# Altium schematic sheet Capstone.SchDoc
size A
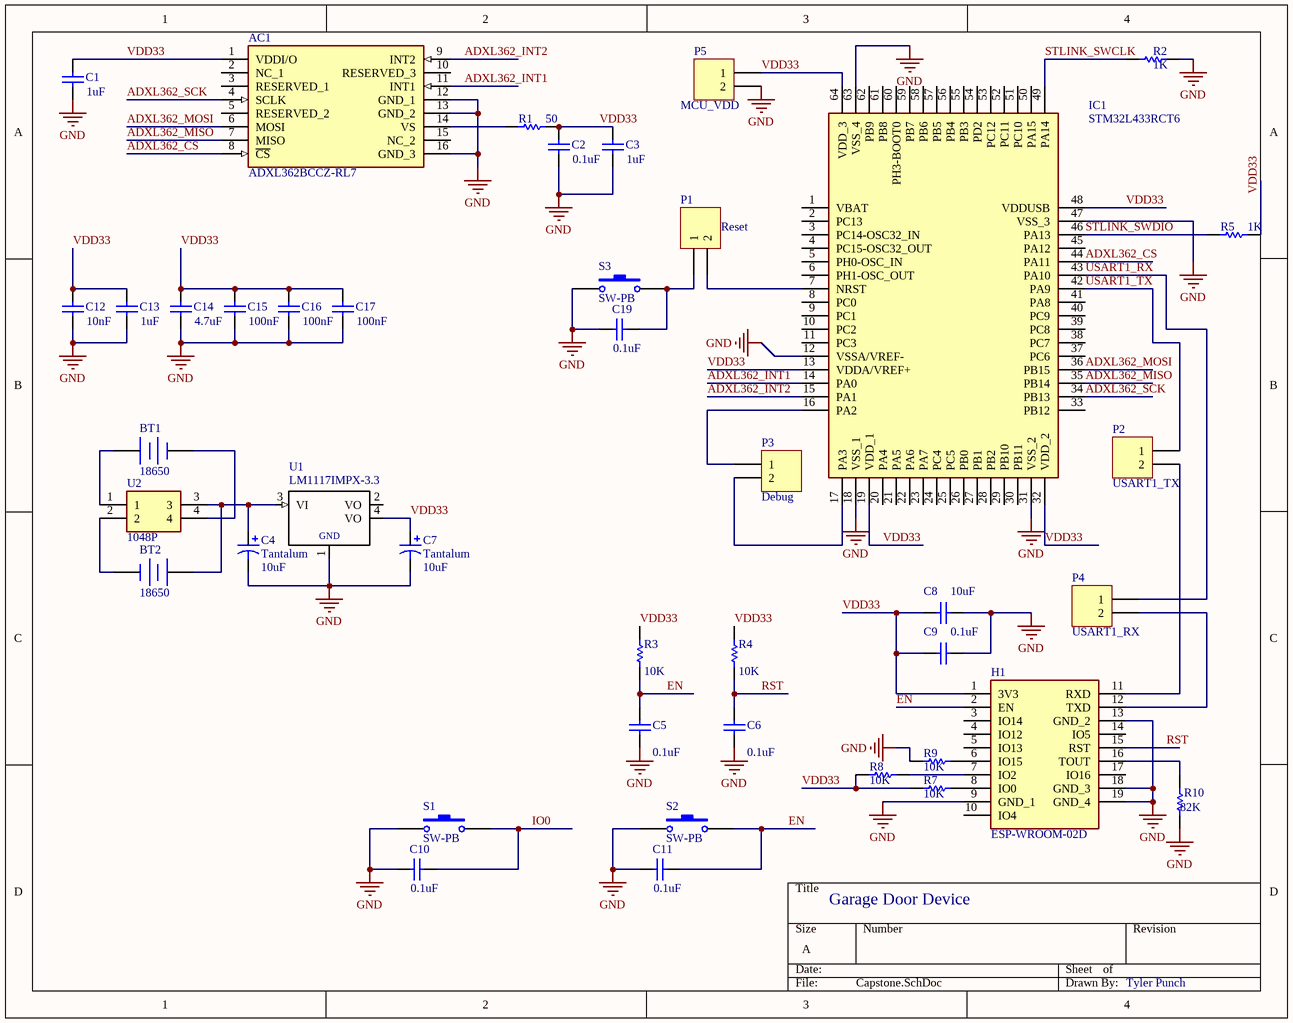
[diagram p0: Capstone.SchDoc]

## Parts
AC1  ADXL362BCCZ-RL7  [CC-16-4]
BT1  18650  [BAT-2]
BT2  18650  [BAT-2]
C1  value 1uF  [*CAPC2012X88N]  (hidden comment: Cap)
C2  value 0.1uF  [*CAPC2012X88N]  (hidden comment: Cap)
C3  value 1uF  [*CAPC2012X88N]  (hidden comment: Cap)
C4  Tantalum  value 10uF  [RB7.6-15]
C5  value 0.1uF  [*CAPC2012X88N]  (hidden comment: Cap)
C6  value 0.1uF  [*CAPC2012X88N]  (hidden comment: Cap)
C7  Tantalum  value 10uF  [RB7.6-15]
C8  value 10uF  [*CAPC2012X88N]  (hidden comment: Cap)
C9  value 0.1uF  [*CAPC2012X88N]  (hidden comment: Cap)
C10  value 0.1uF  [*CAPC2012X88N]  (hidden comment: Cap)
C11  value 0.1uF  [*CAPC2012X88N]  (hidden comment: Cap)
C12  value 10nF  [*CAPC2012X88N]  (hidden comment: Cap)
C13  value 1uF  [*CAPC2012X88N]  (hidden comment: Cap)
C14  value 4.7uF  [*CAPC2012X88N]  (hidden comment: Cap)
C15  value 100nF  [*CAPC2012X88N]  (hidden comment: Cap)
C16  value 100nF  [*CAPC2012X88N]  (hidden comment: Cap)
C17  value 100nF  [*CAPC2012X88N]  (hidden comment: Cap)
C19  value 0.1uF  [RAD-0.3]  (hidden comment: Cap)
H1  ESP-WROOM-02D  [ESPWROOM02D]
IC1  STM32L433RCT6  [QFP50P1200X1200X160-64N]
P1  Reset  [HDR1X2]
P2  USART1_TX  [HDR1X2]
P3  Debug  [HDR1X2]
P4  USART1_RX  [HDR1X2]
P5  MCU_VDD  [HDR1X2]
R1  value 50  [AXIAL-0.3]  (hidden comment: Res1)
R2  value 1K  [AXIAL-0.3]  (hidden comment: Res1)
R3  value 10K  [AXIAL-0.3]  (hidden comment: Res1)
R4  value 10K  [AXIAL-0.3]  (hidden comment: Res1)
R5  value 1K  [AXIAL-0.3]  (hidden comment: Res1)
R7  value 10K  [AXIAL-0.3]  (hidden comment: Res1)
R8  value 10K  [AXIAL-0.3]  (hidden comment: Res1)
R9  value 10K  [AXIAL-0.3]  (hidden comment: Res1)
R10  value 82K  [AXIAL-0.3]  (hidden comment: Res1)
S1  SW-PB  [SPST-2]
S2  SW-PB  [SPST-2]
S3  SW-PB  [SPST-2]
U1  LM1117IMPX-3.3  [*SOT230P700X180-4N]
U2  1048P  [1048P]

## Nets
GND: AC1.12(GND_1) AC1.13(GND_2) AC1.16(GND_3) C1.2 C2.1 C3.2 C4.2 C5.2 C6.2 C7.2 C8.2 C9.2 C10.1 C11.1 C12.1 C13.1 C14.1 C15.1 C16.1 C17.1 C19.1 H1.9(GND_1) H1.13(GND_2) H1.18(GND_3) H1.19(GND_4) IC1.12(VSSA/VREF-) IC1.18(VSS_1) IC1.31(VSS_2) IC1.47(VSS_3) IC1.63(VSS_4) P5.2 R2.2 R9.1 R10.1 S1.1 S2.1 S3.1 U1.1(GND)
ADXL362_CS: AC1.8(~{CS}) IC1.44(PA11)
ADXL362_INT1: AC1.11(INT1) IC1.14(PA0)
ADXL362_INT2: AC1.9(INT2) IC1.15(PA1)
ADXL362_MISO: AC1.7(MISO) IC1.35(PB14)
ADXL362_MOSI: AC1.6(MOSI) IC1.36(PB15)
ADXL362_SCK: AC1.4(SCLK) IC1.34(PB13)
EN: C5.1 C11.2 H1.2(EN) R3.2 S2.2
IO0: C10.2 S1.2
RST: C6.1 H1.15(RST) R4.2
STLINK_SWCLK: IC1.49(PA14) R2.1
STLINK_SWDIO: IC1.46(PA13) R5.1
USART1_RX: IC1.43(PA10) P4.1
USART1_TX: IC1.42(PA9) P2.1
VDD33: AC1.1(VDDI/O) C1.1 C2.2 C3.1 C7.1 C8.1 C9.1 C12.2 C13.2 C14.2 C15.2 C16.2 C17.2 H1.1(3V3) IC1.13(VDDA/VREF+) IC1.19(VDD_1) IC1.32(VDD_2) IC1.48(VDDUSB) IC1.64(VDD_3) P5.1 R1.2 R3.1 R4.1 R5.2 R7.1 R8.1 U1.4(VO)
NetAC1_14: AC1.14(VS) R1.1
NetBT1_1: BT1.1(+) U2.1
NetBT1_2: BT1.2(-) U2.4
NetBT2_1: BT2.1(+) C4.1 U1.3(VI) U2.3
NetBT2_2: BT2.2(-) U2.2
NetC19_2: C19.2 P1.1 S3.2
NetH1_6: H1.6(IO15) R9.2
NetH1_7: H1.7(IO2) R8.2
NetH1_8: H1.8(IO0) R7.2
NetH1_11: H1.11(RXD) P2.2
NetH1_12: H1.12(TXD) P4.2
NetH1_16: H1.16(TOUT) R10.2
NetIC1_7: IC1.7(NRST) P1.2
NetIC1_16: IC1.16(PA2) P3.1
NetIC1_17: IC1.17(PA3) P3.2

Not connected (* = marked no-connect by the designer): AC1 2(NC_1) 3(RESERVED_1) 5(RESERVED_2) 10(RESERVED_3) 15(NC_2); H1 3(IO14) 4(IO12) 5(IO13) 10(IO4) 14(IO5) 17(IO16); IC1 1(VBAT) 2(PC13) 3(PC14-OSC32_IN) 4(PC15-OSC32_OUT) 5(PH0-OSC_IN) 6(PH1-OSC_OUT) 8(PC0) 9(PC1) 10(PC2) 11(PC3) 20(PA4) 21(PA5) 22(PA6) 23(PA7) 24(PC4) 25(PC5) 26(PB0) 27(PB1) 28(PB2) 29(PB10) 30(PB11) 33(PB12) 37(PC6) 38(PC7) 39(PC8) 40(PC9) 41(PA8) 45(PA12) 50(PA15) 51(PC10) 52(PC11) 53(PC12) 54(PD2) 55(PB3) 56(PB4) 57(PB5) 58(PB6) 59(PB7) 60(PH3-BOOT0) 61(PB8) 62(PB9); U1 2(VO)

## Notes on the sheet
- Garage Door Device
- Tyler Punch

## Library data of the parts
AC1 = ADXL362BCCZ-RL7: Accelerometer; Manufacturer_Name: Analog Devices; Datasheet Link: http://www.analog.com/media/en/technical-documentation/data-sheets/ADXL362.pdf; Manufacturer_Part_Number: ADXL362BCCZ-RL7; Mouser Part Number: 584-ADXL362BCCZ-R7; Mouser Price/Stock: https://www.mouser.com/Search/Refine.aspx?Keyword=584-ADXL362BCCZ-R7
BT1 BT2 = Battery: Multicell Battery; Published: 24-Mar-1999; LatestRevisionDate: 17-Jul-2002; LatestRevisionNote: Re-released for DXP Platform.; PackageReference: BAT-2; Publisher: Altium Limited; PackageDescription: Battery; 2 Leads
C1-C3 C5 C6 C8-C17 C19 = Cap: Capacitor; Published: 8-Jun-2000; LatestRevisionDate: 17-Jul-2002; LatestRevisionNote: Re-released for DXP Platform.; PackageReference: RAD-0.3; Publisher: Altium Limited; PackageDescription: Radial Cap, Thru-Hole; 2 Leads; 0.3 in Pin Spacing
C4 C7 = Cap Pol1: Polarized Capacitor (Radial); Published: 8-Jun-2000; LatestRevisionDate: 17-Jul-2002; LatestRevisionNote: Re-released for DXP Platform.; PackageReference: RB7.6-15; Publisher: Altium Limited; PackageDescription: Polarized Capacitor (Radial); 2 Leads
H1 = ESP-WROOM-02D: Hardware; Manufacturer_Name: Espressif; Datasheet Link: https://br.mouser.com/datasheet/2/891/esp-wroom-02d_esp-wroom-02u_datasheet_en-1365835.pdf; Height: 3.2mm; Manufacturer_Part_Number: ESP-WROOM-02D; Mouser Part Number: 356-ESPWROOM-02D
IC1 = STM32L433RCT6: Integrated Circuit; Manufacturer_Name: STMicroelectronics; Datasheet Link: https://www.st.com/resource/en/datasheet/stm32l433rc.pdf; Height: 1.6mm; Manufacturer_Part_Number: STM32L433RCT6; Mouser Part Number: 511-STM32L433RCT6; Mouser Price/Stock: https://www.mouser.com/Search/Refine.aspx?Keyword=511-STM32L433RCT6
P1-P5 = Header 2: Header, 2-Pin; LatestRevisionDate: 17-Jul-2002; LatestRevisionNote: Re-released for DXP Platform.; Publisher: Altium Limited
R1-R5 R7-R10 = Res1: Resistor; Published: 8-Jun-2000; LatestRevisionDate: 17-Jul-2002; LatestRevisionNote: Re-released for DXP Platform.; PackageReference: AXIAL-0.3; Publisher: Altium Limited; PackageDescription: Axial Device, Thru-Hole; 2 Leads; 0.3 in Pin Spacing
S1-S3 = SW-PB: Switch; Published: 24-Mar-1999; LatestRevisionDate: 17-Jul-2002; LatestRevisionNote: Re-released for DXP Platform.; PackageReference: SPST-2; Publisher: Altium Limited; PackageDescription: Switch; 2 Leads
U1 = LM1117MPX-3.3: Linear Regulator, Fix, 3.3v, 800ma, Sot-223-4, Full Reel; MP: LM1117MPX-3.3/NOPB; MF: Texas Instruments; Digi-Key_Purchase_URL: https://www.digikey.com/product-detail/en/texas-instruments/LM1117MPX-3.3-NOPB/LM1117MPX-3.3-NOPBCT-ND/1010516?utm_source=snapeda&utm_medium=aggregator&utm_campaign=symbol; Package: SOT-223-4 Texas Instruments; SnapEDA_Link: https://www.snapeda.com/parts/LM1117MPX-3.3/NOPB/Texas%20Instruments/view-part/?ref=snap; Digi-Key_Part_Number: LM1117MPX-3.3/NOPBCT-ND; Value: *
U2 = 1048P: Undefined or Miscellaneous; Manufacturer_Name: Keystone Electronics; Allied_Number: 71135190; Datasheet Link: http://www.keyelco.com/product-pdf.cfm?p=13959; Manufacturer_Part_Number: 1048P; Mouser Part Number: 534-1048P; Mouser Price/Stock: https://www.mouser.com/Search/Refine.aspx?Keyword=534-1048P; Allied Price/Stock: https://www.alliedelec.com/keystone-electronics-1048p/71135190/